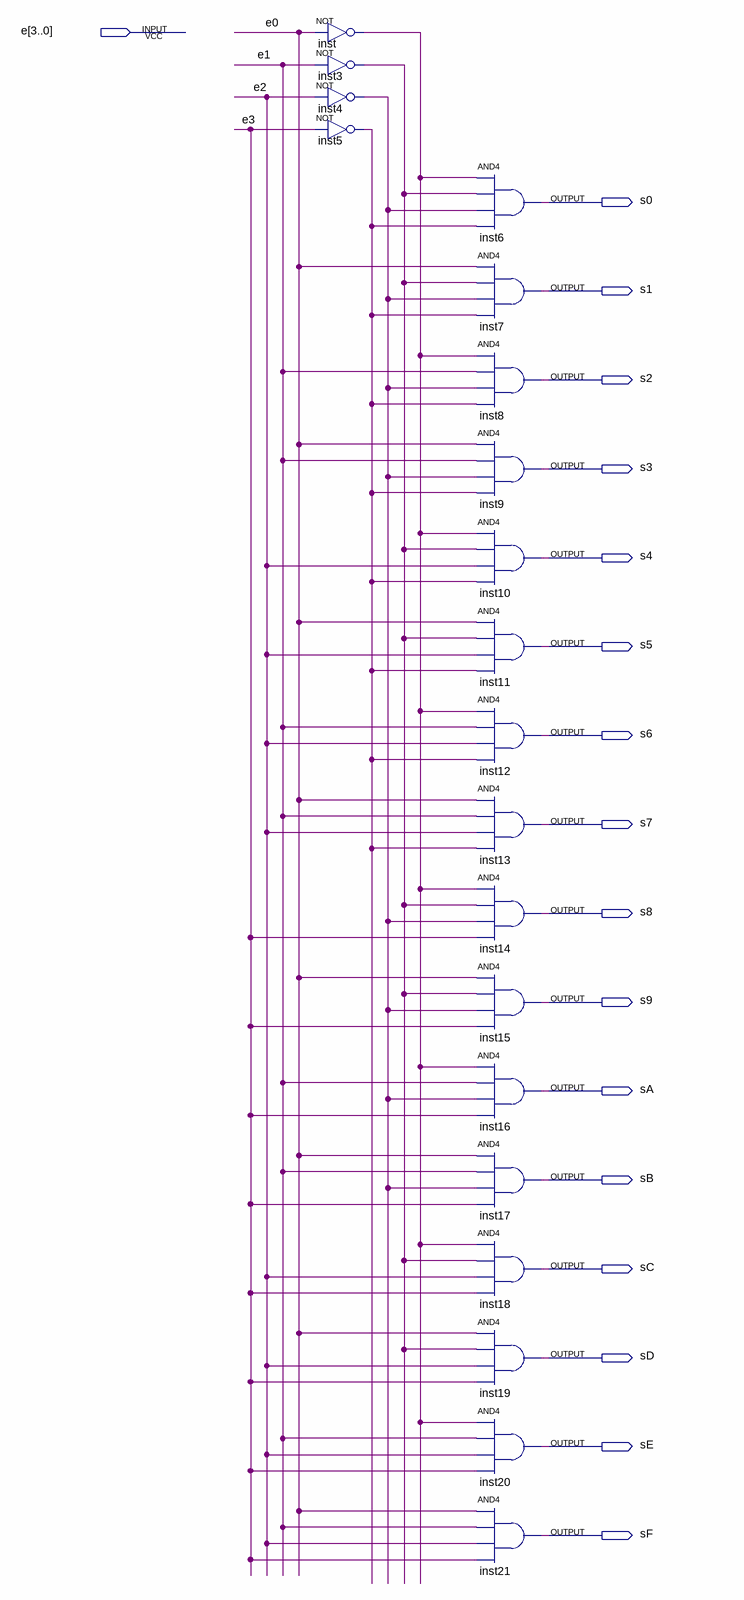
[diagram p0: schematic sheet]
// Quartus schematic decod4x16.bdf as structural Verilog: 20 symbols, 17 pins
module decod4x16 (
  input  [3:0] e,
  output s0,
  output s1,
  output s2,
  output s3,
  output s4,
  output s5,
  output s6,
  output s7,
  output s8,
  output s9,
  output sA,
  output sB,
  output sC,
  output sD,
  output sE,
  output sF
);

  wire inst3_out, inst4_out, inst5_out, inst_out;

  not inst (inst_out, e[0]);
  not inst3 (inst3_out, e[1]);
  not inst4 (inst4_out, e[2]);
  not inst5 (inst5_out, e[3]);
  and inst6 (s0, inst_out, inst3_out, inst4_out, inst5_out);
  and inst7 (s1, e[0], inst3_out, inst4_out, inst5_out);
  and inst8 (s2, inst_out, e[1], inst4_out, inst5_out);
  and inst9 (s3, e[0], e[1], inst4_out, inst5_out);
  and inst10 (s4, inst_out, inst3_out, e[2], inst5_out);
  and inst11 (s5, e[0], inst3_out, e[2], inst5_out);
  and inst12 (s6, inst_out, e[1], e[2], inst5_out);
  and inst13 (s7, e[0], e[1], e[2], inst5_out);
  and inst14 (s8, inst_out, inst3_out, inst4_out, e[3]);
  and inst15 (s9, e[0], inst3_out, inst4_out, e[3]);
  and inst16 (sA, inst_out, e[1], inst4_out, e[3]);
  and inst17 (sB, e[0], e[1], inst4_out, e[3]);
  and inst18 (sC, inst_out, inst3_out, e[2], e[3]);
  and inst19 (sD, e[0], inst3_out, e[2], e[3]);
  and inst20 (sE, inst_out, e[1], e[2], e[3]);
  and inst21 (sF, e[0], e[1], e[2], e[3]);
endmodule
